# Altium project two_ax_PCB.PrjPcb
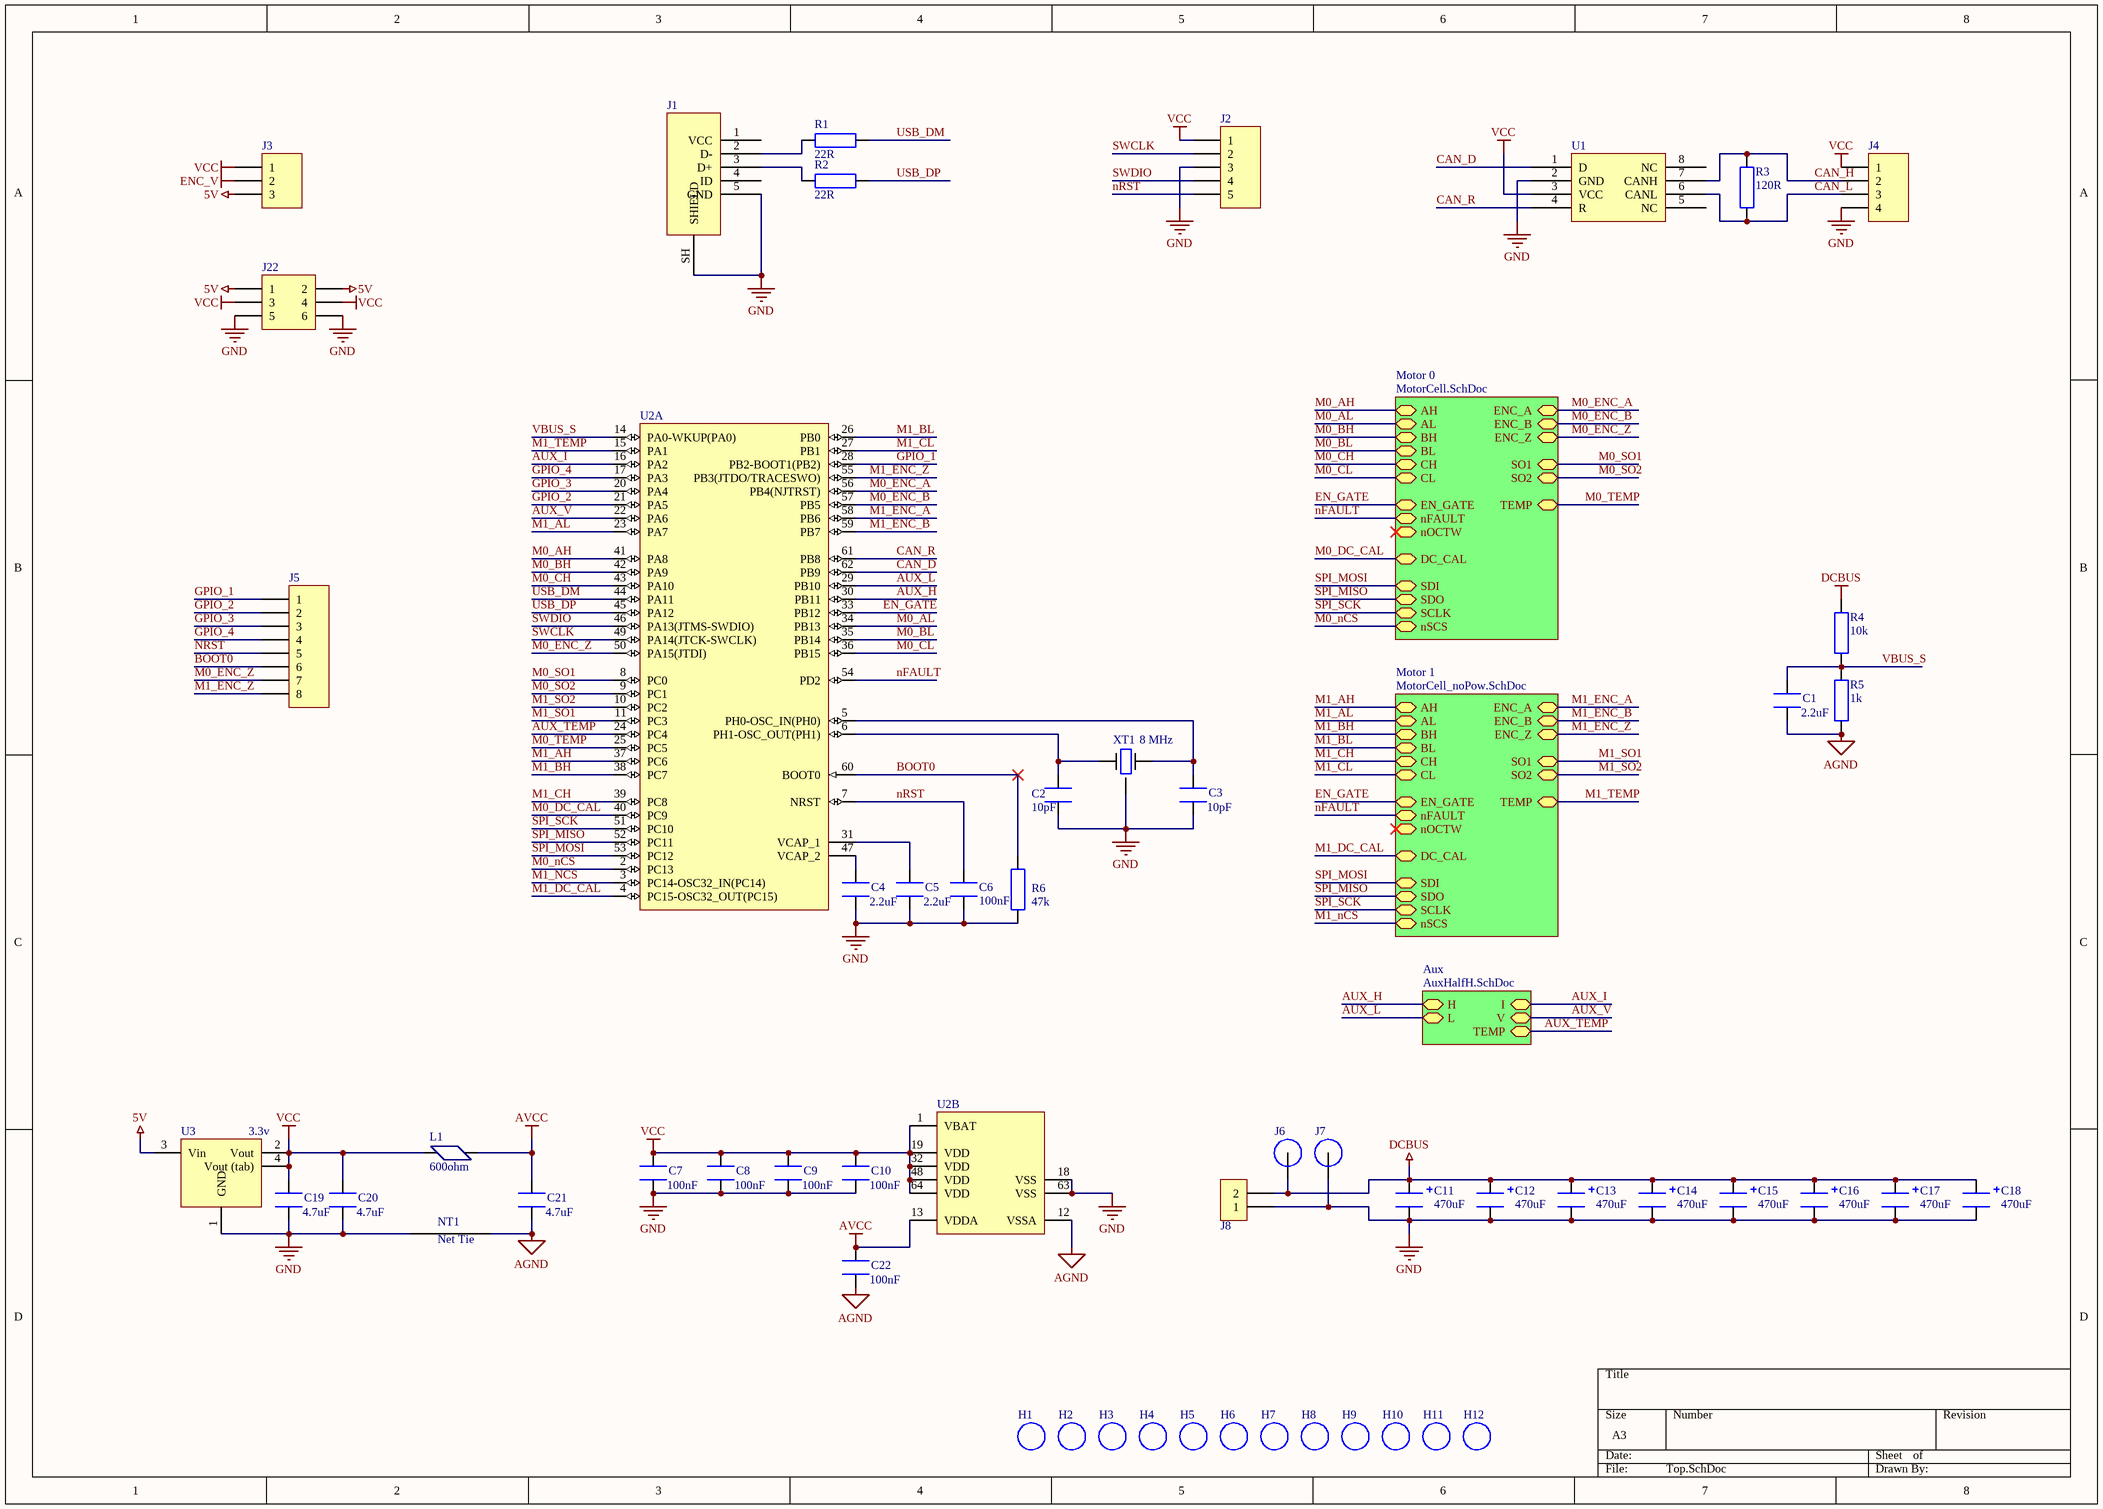
[diagram p0: Top.SchDoc]
4 sheets, 191 parts. Net scope: hierarchical (ports join the sheet entries above them; power ports are global).
Board file: PCB.PcbDoc
Sheets:
  Top.SchDoc
    Motor 0 = MotorCell.SchDoc
    Motor 1 = MotorCell_noPow.SchDoc
    Aux = AuxHalfH.SchDoc

## Sheet Top.SchDoc
size A3; SheetNumber: 1

### Parts
C1  value 2.2uF  [1608[0603]]
C2  value 10pF  [1608[0603]]
C3  value 10pF  [1608[0603]]
C4  value 2.2uF  [1608[0603]]
C5  value 2.2uF  [1608[0603]]
C6  value 100nF  [1608[0603]]
C7  value 100nF  [1608[0603]]
C8  value 100nF  [1608[0603]]
C9  value 100nF  [1608[0603]]
C10  value 100nF  [1608[0603]]
C11  value 470uF  [CAP_ELEC_SIZE_G]
C12  value 470uF  [CAP_ELEC_SIZE_G]
C13  value 470uF  [CAP_ELEC_SIZE_G]
C14  value 470uF  [CAP_ELEC_SIZE_G]
C15  value 470uF  [CAP_ELEC_SIZE_G]
C16  value 470uF  [CAP_ELEC_SIZE_G]
C17  value 470uF  [CAP_ELEC_SIZE_G]
C18  value 470uF  [CAP_ELEC_SIZE_G]
C19  value 4.7uF  [CAPC2012X09N]
C20  value 4.7uF  [CAPC2012X09N]
C21  value 4.7uF  [CAPC2012X09N]
C22  value 100nF  [1608[0603]]
H1  (no value)  [M3 Hole]
H2  (no value)  [M3 Hole]
H3  (no value)  [M3 Hole]
H4  (no value)  [M3 Hole]
H5  (no value)  [M3 Hole]
H6  (no value)  [M3 Hole]
H7  (no value)  [M3 Hole]
H8  (no value)  [M3 Hole]
H9  (no value)  [M3 Hole]
H10  (no value)  [M3 Hole]
H11  (no value)  [M3 Hole]
H12  (no value)  [M3 Hole]
J1  (no value)  [USB_0103594-0001LF]
J2  (no value)  [HDR1X5]
J3  (no value)  [HDR1X3]
J4  (no value)  [HDR1X4]
J5  (no value)  [HDR1X8]
J6  (no value)  [M3 Spade Hole]
J7  (no value)  [M3 Spade Hole]
J8  (no value)  [MC000054]
J22  (no value)  [HDR2X3]
L1  value 600ohm  [FBC2012N]
NT1  (no value)  [NetTie_2mm]  (net tie, no BOM)
R1  value 22R  [RESC1608X55N]
R2  value 22R  [RESC1608X55N]
R3  value 120R  [RESC1608X55N]
R4  value 10k  [RESC1608X55N]
R5  value 1k  [RESC1608X55N]
R6  value 47k  [RESC1608X55N]
U1  (no value)  [SOIC127P600X175-8N]
U2  (no value)  [STM-LQFP64_N]  (parts A,B of 2)
U3  value 3.3v  [SOT223]
XT1  value 8 MHz  [DFN220P320X110-4N]

### Sub-sheets
Aux = AuxHalfH.SchDoc: H, L, I, TEMP, V
Motor 0 = MotorCell.SchDoc: nFAULT, nOCTW, EN_GATE, DC_CAL, SDI, SDO, SCLK, nSCS, SO1, SO2, ENC_A, ENC_B, ENC_Z, AH, AL, BH, BL, CH, CL, TEMP
Motor 1 = MotorCell_noPow.SchDoc: nFAULT, nOCTW, EN_GATE, DC_CAL, SDI, SDO, SCLK, nSCS, SO1, SO2, ENC_A, ENC_B, ENC_Z, AH, AL, BH, BL, CH, CL, TEMP

### Nets
5V: J3.3 J22.1 J22.2 U3.3(Vin)
AGND: C1.1 C21.1 C22.2 NT1.2 R5.2 U2.12(VSSA)
AVCC: C21.2 C22.1 L1.1 U2.13(VDDA)
DCBUS: C11.1 C12.1 C13.1 C14.1 C15.1 C16.1 C17.1 C18.1 J6.1 J8.2 R4.1
ENC_V: J3.2
GND: C2.2 C3.2 C4.1 C5.1 C6.1 C7.2 C8.2 C9.2 C10.2 C11.2 C12.2 C13.2 C14.2 C15.2 C16.2 C17.2 C18.2 C19.1 C20.1 J1.5(GND) J1.SH(SHIELD) J2.3 J4.4 J7.1 J8.1 J22.5 J22.6 NT1.1 R6.2 U1.2(GND) U2.18(VSS) U2.63(VSS) U3.1(GND) XT1.G
VCC: C7.1 C8.1 C9.1 C10.1 C19.2 C20.2 J2.1 J3.1 J4.1 J22.3 J22.4 L1.2 U1.3(VCC) U2.1(VBAT) U2.19(VDD) U2.32(VDD) U2.48(VDD) U2.64(VDD) U3.2(Vout) U3.4(Vout_(tab))
AUX_H: U2.30(PB11) ; sheet Aux/H
AUX_I: U2.16(PA2) ; sheet Aux/I
AUX_L: U2.29(PB10) ; sheet Aux/L
AUX_TEMP: U2.24(PC4) ; sheet Aux/TEMP
AUX_V: U2.22(PA6) ; sheet Aux/V
BOOT0: J5.6 R6.1 U2.60(BOOT0)  [project net BOOT0_1]
CAN_D: U1.1(D) U2.62(PB9)  [project net CAN_D_1]
CAN_H: J4.2 R3.2 U1.7(CANH)  [project net CAN_H_1]
CAN_L: J4.3 R3.1 U1.6(CANL)  [project net CAN_L_1]
CAN_R: U1.4(R) U2.61(PB8)  [project net CAN_R_1]
EN_GATE: U2.33(PB12) ; sheet Motor 0/EN_GATE, sheet Motor 1/EN_GATE
GPIO_1: J5.1 U2.28(PB2-BOOT1(PB2))  [project net GPIO_1_1]
GPIO_2: J5.2 U2.21(PA5)  [project net GPIO_2_1]
GPIO_3: J5.3 U2.20(PA4)  [project net GPIO_3_1]
GPIO_4: J5.4 U2.17(PA3)  [project net GPIO_4_1]
M0_AH: U2.41(PA8) ; sheet Motor 0/AH
M0_AL: U2.34(PB13) ; sheet Motor 0/AL
M0_BH: U2.42(PA9) ; sheet Motor 0/BH
M0_BL: U2.35(PB14) ; sheet Motor 0/BL
M0_CH: U2.43(PA10) ; sheet Motor 0/CH
M0_CL: U2.36(PB15) ; sheet Motor 0/CL
M0_DC_CAL: U2.40(PC9) ; sheet Motor 0/DC_CAL
M0_ENC_A: U2.56(PB4(NJTRST)) ; sheet Motor 0/ENC_A
M0_ENC_B: U2.57(PB5) ; sheet Motor 0/ENC_B
M0_ENC_Z: J5.7 U2.50(PA15(JTDI)) ; sheet Motor 0/ENC_Z
M0_nCS: U2.2(PC13) ; sheet Motor 0/nSCS
M0_SO1: U2.8(PC0) ; sheet Motor 0/SO1
M0_SO2: U2.9(PC1) ; sheet Motor 0/SO2
M0_TEMP: U2.25(PC5) ; sheet Motor 0/TEMP
M1_AH: U2.37(PC6) ; sheet Motor 1/AH
M1_AL: U2.23(PA7) ; sheet Motor 1/AL
M1_BH: U2.38(PC7) ; sheet Motor 1/BH
M1_BL: U2.26(PB0) ; sheet Motor 1/BL
M1_CH: U2.39(PC8) ; sheet Motor 1/CH
M1_CL: U2.27(PB1) ; sheet Motor 1/CL
M1_DC_CAL: U2.4(PC15-OSC32_OUT(PC15)) ; sheet Motor 1/DC_CAL
M1_ENC_A: U2.58(PB6) ; sheet Motor 1/ENC_A
M1_ENC_B: U2.59(PB7) ; sheet Motor 1/ENC_B
M1_ENC_Z: J5.8 U2.55(PB3(JTDO/TRACESWO)) ; sheet Motor 1/ENC_Z
M1_nCS: U2.3(PC14-OSC32_IN(PC14)) ; sheet Motor 1/nSCS
M1_SO1: U2.11(PC3) ; sheet Motor 1/SO1
M1_SO2: U2.10(PC2) ; sheet Motor 1/SO2
M1_TEMP: U2.15(PA1) ; sheet Motor 1/TEMP
nFAULT: U2.54(PD2) ; sheet Motor 0/nFAULT, sheet Motor 1/nFAULT
nRST: C6.2 J2.5 J5.5 U2.7(NRST)  [project net nRST_1]
SPI_MISO: U2.52(PC11) ; sheet Motor 0/SDO, sheet Motor 1/SDO
SPI_MOSI: U2.53(PC12) ; sheet Motor 0/SDI, sheet Motor 1/SDI
SPI_SCK: U2.51(PC10) ; sheet Motor 0/SCLK, sheet Motor 1/SCLK
SWCLK: J2.2 U2.49(PA14(JTCK-SWCLK))  [project net SWCLK_1]
SWDIO: J2.4 U2.46(PA13(JTMS-SWDIO))  [project net SWDIO_1]
USB_DM: R1.2 U2.44(PA11)  [project net USB_DM_1]
USB_DP: R2.2 U2.45(PA12)  [project net USB_DP_1]
VBUS_S: C1.2 R4.2 R5.1 U2.14(PA0-WKUP(PA0))  [project net VBUS_S_1]
NetC2_1: C2.1 U2.6(PH1-OSC_OUT(PH1)) XT1.1
NetC3_1: C3.1 U2.5(PH0-OSC_IN(PH0)) XT1.3
NetC4_2: C4.2 U2.47(VCAP_2)
NetC5_2: C5.2 U2.31(VCAP_1)
NetJ1_2: J1.2(D-) R1.1
NetJ1_3: J1.3(D+) R2.1

Not connected (* = marked no-connect by the designer): J1 1(VCC) 4(ID); U1 5(NC) 8(NC)

### Notes on the sheet
- (in symbol NetTie_2mm) Net Tie

### Library data of the parts
C1-C10 C22 = CAP_0603: CAP General 0603
C11-C18 = EEEFP1E471AP: CAP, FP Series, 470 µF, 25 V, Radial Can - SMD, 10 mm
C19-C21 = GRM219R6YA475KA73D: CAP CER 4.7UF 35V X5R 0805
H1-H12 = M3 Hole: M3 Hole with no copper
J1 = 10103594-0001LF: MICRO USB B, RECEPTACLE, SMT, RA, 5WAY; Supplier 1: Farnell; Supplier Part Number 1: 2293752
J2 = Header 5: Header, 5-Pin; LatestRevisionDate: 17-Jul-2002; LatestRevisionNote: Re-released for DXP Platform.; Publisher: Altium Limited
J3 = Header 3: Header, 3-Pin; LatestRevisionDate: 17-Jul-2002; LatestRevisionNote: Re-released for DXP Platform.; Publisher: Altium Limited
J4 = Header 4: Header, 4-Pin; LatestRevisionDate: 17-Jul-2002; LatestRevisionNote: Re-released for DXP Platform.; Publisher: Altium Limited
J5 = Header 8: Header, 8-Pin; LatestRevisionDate: 17-Jul-2002; LatestRevisionNote: Re-released for DXP Platform.; Publisher: Altium Limited
J6 J7 = M3 Spade Terminal
J8 = MC000054: MULTICOMP Wire-To-Board Terminal Block, 2, 600 V, 30 A, 24 AWG, 10 AWG
J22 = Header 3X2: Header, 3-Pin, Dual row; LatestRevisionDate: 17-Jul-2002; LatestRevisionNote: Re-released for DXP Platform.; Publisher: Altium Limited
L1 = 2508056017Y2: FERRITE BEAD, 0.1OHM, 2A, 0805; Supplier 1: Farnell; Supplier 2: Farnell; Supplier Part Number 1: 1838838; Supplier Part Number 2: 1838838RL
NT1 = NetTie_2mm
R1-R6 = RES_0603: RES General 1% 0603
U1 = SN65HVD232D: 3.3-V CAN Bus Transceiver
U2 = STM32F405RGT6: ARM Cortex-M4 32-bit MCU+FPU, 210 DMIPS, 1024 kB Flash, 192 kB Internal RAM, 51 I/Os, 64-pin LQFP, -40 to 85 degC, Tray; Manufacturer: STMicroelectronics; D/A Converter: 2x12-bit; FLASH Size (Prog) (kB): 1024; I/Os (High Current): 51; Internal RAM Size (kB): 192; Operating Frequency(F) (Processor speed) (MHz): 168; Supply Voltage(Vcc) max (V): 3.6; Supply Voltage(Vcc) min (V): 1.8; DatasheetVersion: Rev. 4; PackageVersion: Rev. 4, 06/2013; PackageReference: LQFP64; PackageDescription: 64-Pin Low Profile Quad Flat Package, 10 x 10 mm Body, 0.5 mm Pitch; Supplier 1: Digi-Key; Supplier Part Number 1: 497-11767-ND; Supplier 2: Farnell; Supplier Part Number 2: 2064363; Supplier 3: Newark; Supplier Part Number 3: 73T2329; Supplier 4: Mouser; Supplier Part Number 4: 511-STM32F405RGT6; Core: ARM Cortex-M4; Packing: Tray; Mounting Technology: Surface Mount; PartNumber: STM32F405RGT6; ComponentLink1Description: Manufacturer URL; ComponentLink1URL: http://www.st.com/web/en/home.html; ComponentLink2Description: Datasheet; ComponentLink2URL: http://www.st.com/st-web-ui/static/active/en/resource/technical/document/datasheet/DM00037051.pdf; ComponentLink3Description: Package Specification; ComponentLink3URL: http://www.st.com/st-web-ui/static/active/en/resource/technical/document/datasheet/DM00037051.pdf
U3 = AP1117E33G-13: IC, LDO, REG, 3.3V, SOT223; Supplier 1: Farnell; Supplier 2: Farnell; Supplier Part Number 1: 1825291RL; Supplier Part Number 2: 1825291
XT1 = ABM3B-8.000MHZ-10-1-U-T: Crystal 8MHz ±10ppm 10pF 200 Ohm -10°C ~ 60°C Surface Mount 4-SMD, No Lead (DFN, LCC)

## Sheet MotorCell.SchDoc
size A3; SheetNumber: 2
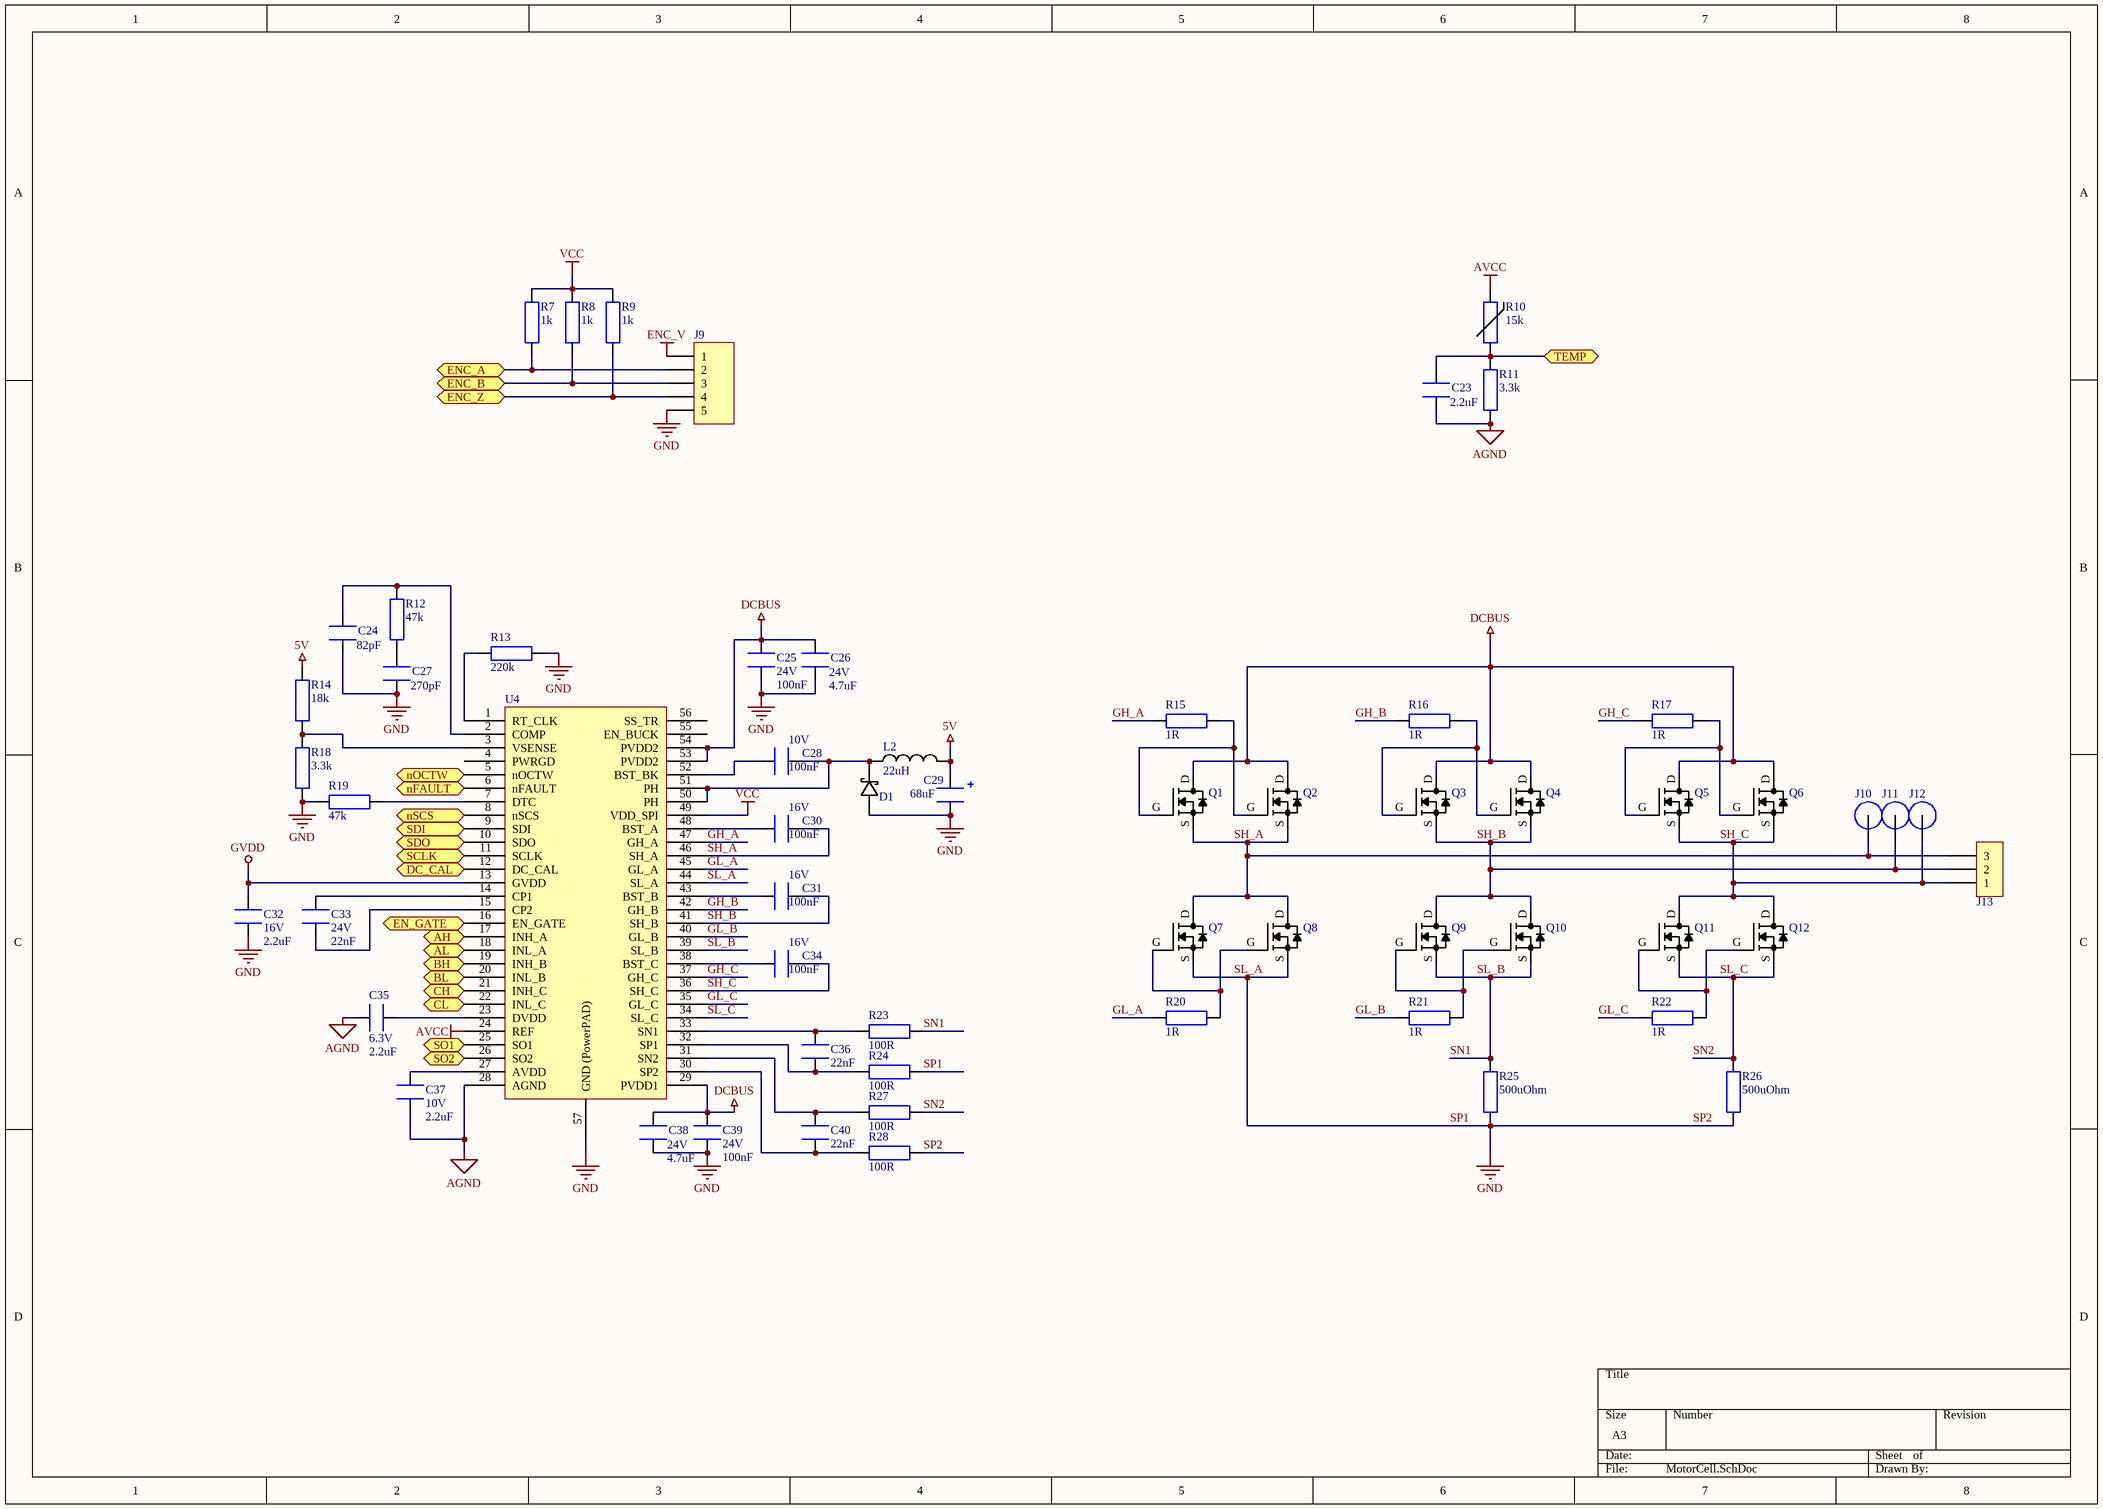
[diagram p1: MotorCell.SchDoc]

### Parts
C23  value 2.2uF  [1608[0603]]
C24  value 82pF  [1608[0603]]
C25  24V  value 100nF  [1608[0603]]
C26  24V  value 4.7uF  [CAPC2012X09N]
C27  value 270pF  [1608[0603]]
C28  10V  value 100nF  [1608[0603]]
C29  value 68uF  [CAPCP6032X28N]
C30  16V  value 100nF  [1608[0603]]
C31  16V  value 100nF  [1608[0603]]
C32  16V  value 2.2uF  [1608[0603]]
C33  24V  value 22nF  [1608[0603]]
C34  16V  value 100nF  [1608[0603]]
C35  6.3V  value 2.2uF  [1608[0603]]
C36  value 22nF  [1608[0603]]
C37  10V  value 2.2uF  [1608[0603]]
C38  24V  value 4.7uF  [CAPC2012X09N]
C39  24V  value 100nF  [1608[0603]]
C40  value 22nF  [1608[0603]]
D1  (no value)  [DO-214AA]
J9  (no value)  [HDR1X5]
J10  (no value)  [M3 Spade Hole]
J11  (no value)  [M3 Spade Hole]
J12  (no value)  [M3 Spade Hole]
J13  (no value)  [MC000051]
L2  value 22uH  [INDC6060X28N]
Q1  (no value)  [SO8FL]
Q2  (no value)  [SO8FL_FILL]
Q3  (no value)  [SO8FL]
Q4  (no value)  [SO8FL_FILL]
Q5  (no value)  [SO8FL]
Q6  (no value)  [SO8FL_FILL]
Q7  (no value)  [SO8FL]
Q8  (no value)  [SO8FL]
Q9  (no value)  [SO8FL]
Q10  (no value)  [SO8FL]
Q11  (no value)  [SO8FL]
Q12  (no value)  [SO8FL]
R7  value 1k  [RESC1608X55N]
R8  value 1k  [RESC1608X55N]
R9  value 1k  [RESC1608X55N]
R10  value 15k  [RESC1608X06L]
R11  value 3.3k  [RESC1608X55N]
R12  value 47k  [RESC1608X55N]
R13  value 220k  [RESC1608X55N]
R14  value 18k  [RESC1608X55N]
R15  value 1R  [RESC1608X55N]
R16  value 1R  [RESC1608X55N]
R17  value 1R  [RESC1608X55N]
R18  value 3.3k  [RESC1608X55N]
R19  value 47k  [RESC1608X55N]
R20  value 1R  [RESC1608X55N]
R21  value 1R  [RESC1608X55N]
R22  value 1R  [RESC1608X55N]
R23  value 100R  [RESC1608X55N]
R24  value 100R  [RESC1608X55N]
R25  value 500uOhm  [RESC6432X09N]
R26  value 500uOhm  [RESC6432X09N]
R27  value 100R  [RESC1608X55N]
R28  value 100R  [RESC1608X55N]
U4  (no value)  [TSSOP50P810X120_HS-57N]

### Ports
AH, AL, BH, BL, CH, CL, DC_CAL, EN_GATE, ENC_A, ENC_B, ENC_Z, nFAULT, nOCTW, nSCS, SCLK, SDI, SDO, SO1, SO2, TEMP

### Nets
5V: C29.1 L2.2 R14.1
AGND: C23.1 C35.1 C37.1 R11.2 U4.28(AGND)
AVCC: R10.2 U4.24(REF)
DCBUS: C25.1 C26.2 C38.2 C39.1 Q1.D Q2.D Q3.D Q4.D Q5.D Q6.D U4.29(PVDD1) U4.53(PVDD2) U4.54(PVDD2)
ENC_V: J9.1
GND: C24.2 C25.2 C26.1 C27.2 C29.2 C32.1 C38.1 C39.2 D1.A J9.5 Q7.S Q8.S R13.2 R18.2 R19.2 R24.1 R25.1 R26.1 R28.1 U4.44(SL_A) U4.57(GND_(PowerPAD))  [also labelled SL_A, SP1, SP2]
GVDD: C32.2 U4.13(GVDD)
VCC: R7.1 R8.1 R9.1 U4.49(VDD_SPI)
EN_GATE: U4.16(EN_GATE) ; port EN_GATE
GH_A: R15.1 U4.47(GH_A)  [project net GH_A_2]
GH_B: R16.1 U4.42(GH_B)  [project net GH_B_2]
GH_C: R17.1 U4.37(GH_C)  [project net GH_C_2]
GL_A: R20.1 U4.45(GL_A)  [project net GL_A_2]
GL_B: R21.1 U4.40(GL_B)  [project net GL_B_2]
GL_C: R22.1 U4.35(GL_C)  [project net GL_C_2]
M0_AH: U4.17(INH_A) ; port AH
M0_AL: U4.18(INL_A) ; port AL
M0_BH: U4.19(INH_B) ; port BH
M0_BL: U4.20(INL_B) ; port BL
M0_CH: U4.21(INH_C) ; port CH
M0_CL: U4.22(INL_C) ; port CL
M0_DC_CAL: U4.12(DC_CAL) ; port DC_CAL
M0_ENC_A: J9.2 R7.2 ; port ENC_A
M0_ENC_B: J9.3 R8.2 ; port ENC_B
M0_ENC_Z: J9.4 R9.2 ; port ENC_Z
M0_nCS: U4.8(nSCS) ; port nSCS
M0_SO1: U4.25(SO1) ; port SO1
M0_SO2: U4.26(SO2) ; port SO2
M0_TEMP: C23.2 R10.1 R11.1 ; port TEMP
nFAULT: U4.6(nFAULT) ; port nFAULT
SH_A: C30.1 J10.1 J13.3 Q1.S Q2.S Q7.D Q8.D U4.46(SH_A)  [project net SH_A_2]
SH_B: C31.1 J11.1 J13.2 Q3.S Q4.S Q9.D Q10.D U4.41(SH_B)  [project net SH_B_2]
SH_C: C34.1 J12.1 J13.1 Q5.S Q6.S Q11.D Q12.D U4.36(SH_C)  [project net SH_C_2]
SL_B: Q9.S Q10.S R23.1 R25.2 U4.39(SL_B)  [also labelled SN1]  [project net SL_B_2]
SL_C: Q11.S Q12.S R26.2 R27.1 U4.34(SL_C)  [also labelled SN2]  [project net SL_C_2]
SPI_MISO: U4.10(SDO) ; port SDO
SPI_MOSI: U4.9(SDI) ; port SDI
SPI_SCK: U4.11(SCLK) ; port SCLK
NetC24_1: C24.1 R12.1 U4.2(COMP)
NetC27_1: C27.1 R12.2
NetC28_1: C28.1 D1.K L2.1 U4.50(PH) U4.51(PH)
NetC28_2: C28.2 U4.52(BST_BK)
NetC30_2: C30.2 U4.48(BST_A)
NetC31_2: C31.2 U4.43(BST_B)
NetC33_1: C33.1 U4.14(CP1)
NetC33_2: C33.2 U4.15(CP2)
NetC34_2: C34.2 U4.38(BST_C)
NetC35_2: C35.2 U4.23(DVDD)
NetC36_1: C36.1 R23.2 U4.33(SN1)
NetC36_2: C36.2 R24.2 U4.32(SP1)
NetC37_2: C37.2 U4.27(AVDD)
NetC40_1: C40.1 R27.2 U4.31(SN2)
NetC40_2: C40.2 R28.2 U4.30(SP2)
NetQ1_G: Q1.G Q2.G R15.2
NetQ3_G: Q3.G Q4.G R16.2
NetQ5_G: Q5.G Q6.G R17.2
NetQ7_G: Q7.G Q8.G R20.2
NetQ9_G: Q9.G Q10.G R21.2
NetQ11_G: Q11.G Q12.G R22.2
NetR13_1: R13.1 U4.1(RT_CLK)
NetR14_2: R14.2 R18.1 U4.3(VSENSE)
NetR19_1: R19.1 U4.7(DTC)
NetU4_5: U4.5(nOCTW) ; port nOCTW

Not connected (* = marked no-connect by the designer): U4 4(PWRGD) 55(EN_BUCK) 56(SS_TR)

### Library data of the parts
C23-C25 C27 C28 C30-C37 C39 C40 = CAP_0603: CAP General 0603
C26 C38 = GRM219R6YA475KA73D: CAP CER 4.7UF 35V X5R 0805
C29 = T495C686M016ATE250: CAP TANT 68UF 16V 20% 2312 250mOhm
D1 = SS13B: DIODE, SCHOTTK, RECTIF, 1A, 30V, SMB; Supplier 1: Farnell; Supplier Part Number 1: 1861425
J9 = Header 5: Header, 5-Pin; LatestRevisionDate: 17-Jul-2002; LatestRevisionNote: Re-released for DXP Platform.; Publisher: Altium Limited
J10-J12 = M3 Spade Terminal
J13 = MC000051: TERMINAL BLOCK, WIRE TO BRD, 3POS, 10AWG; Supplier 1: Farnell; Supplier Part Number 1: 2008022
L2 = NR6028T220M: INDUCTOR 22UH 1.4A 175.5 MOHM
Q1-Q12 = NTMFS4937NT1G: MOSFET, N CH, 30V, 70A, SO-8 FL; Supplier 1: Farnell; Supplier Part Number 1: 2317605; Supplier 2: Farnell; Supplier Part Number 2: 2317605RL
R7-R9 R11-R24 R27 R28 = RES_0603: RES General 1% 0603
R10 = NTCS0603E3153JMT: THERMISTOR, 15K, 5%, SMD, NTC; Supplier 1: Farnell; Supplier Part Number 1: 2103168
R25 R26 = CSR2512C0R0005F: RES SMD 0.0005 OHM 1% 3W 2512
U4 = DRV8301: MOTOR DRIVER, 3PH, 56HTSSOP

## Sheet MotorCell_noPow.SchDoc
size A3; SheetNumber: 3
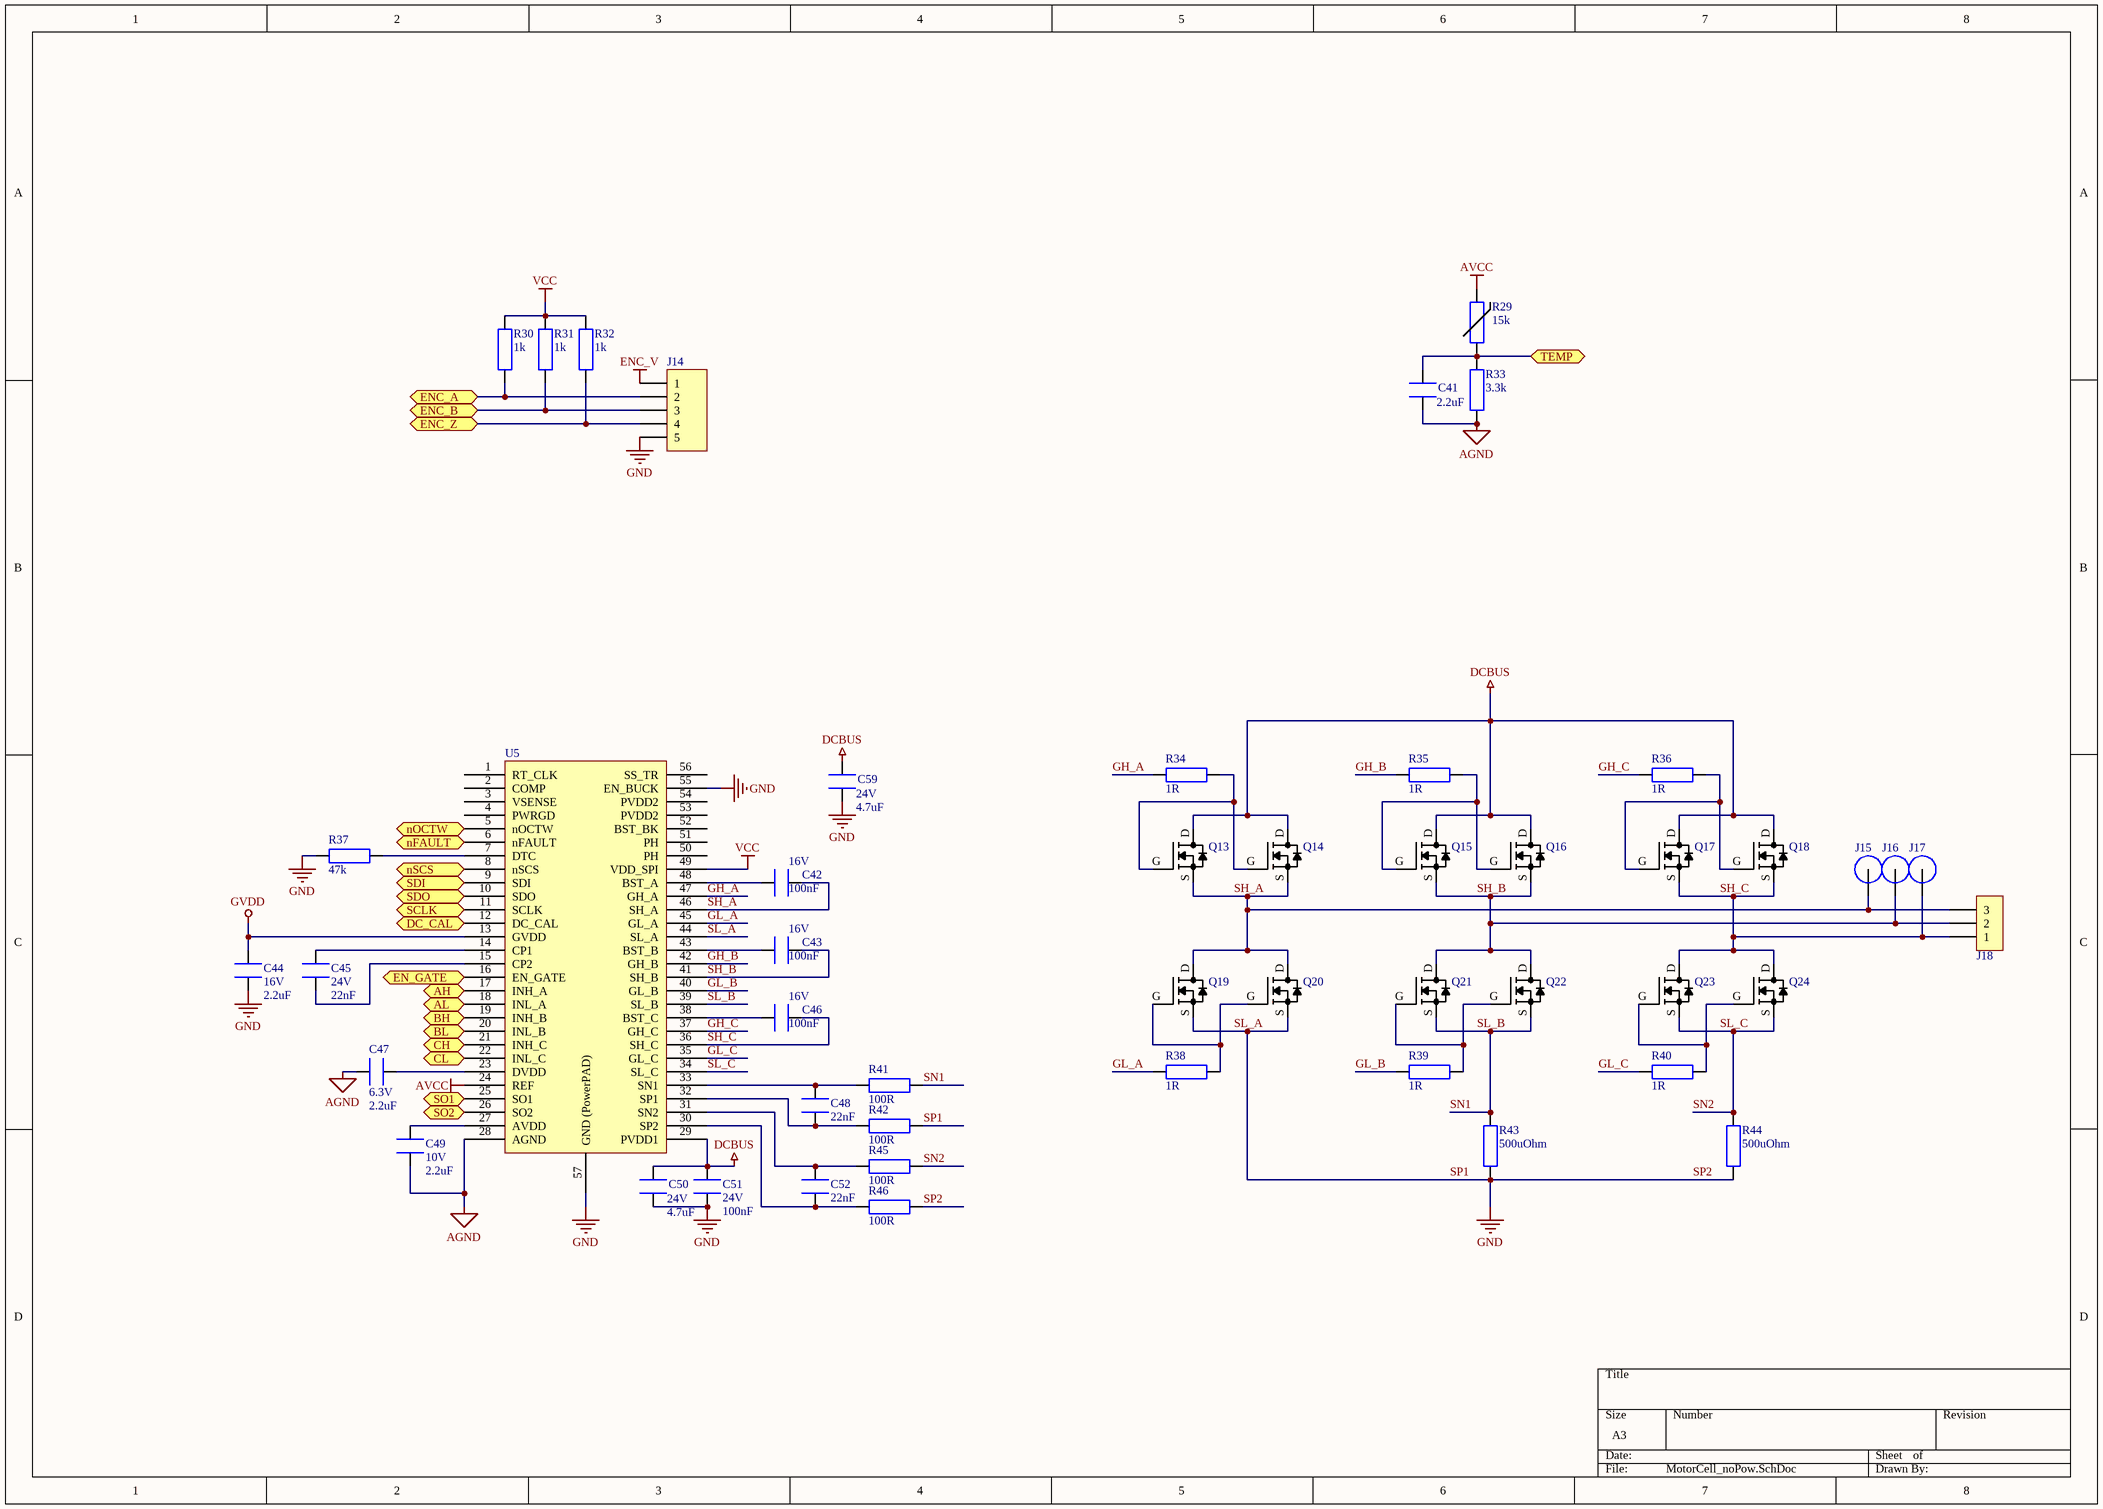
[diagram p2: MotorCell_noPow.SchDoc]

### Parts
C41  value 2.2uF  [1608[0603]]
C42  16V  value 100nF  [1608[0603]]
C43  16V  value 100nF  [1608[0603]]
C44  16V  value 2.2uF  [1608[0603]]
C45  24V  value 22nF  [1608[0603]]
C46  16V  value 100nF  [1608[0603]]
C47  6.3V  value 2.2uF  [1608[0603]]
C48  value 22nF  [1608[0603]]
C49  10V  value 2.2uF  [1608[0603]]
C50  24V  value 4.7uF  [CAPC2012X09N]
C51  24V  value 100nF  [1608[0603]]
C52  value 22nF  [1608[0603]]
C59  24V  value 4.7uF  [CAPC2012X09N]
J14  (no value)  [HDR1X5]
J15  (no value)  [M3 Spade Hole]
J16  (no value)  [M3 Spade Hole]
J17  (no value)  [M3 Spade Hole]
J18  (no value)  [MC000051]
Q13  (no value)  [SO8FL]
Q14  (no value)  [SO8FL_FILL]
Q15  (no value)  [SO8FL]
Q16  (no value)  [SO8FL_FILL]
Q17  (no value)  [SO8FL]
Q18  (no value)  [SO8FL_FILL]
Q19  (no value)  [SO8FL]
Q20  (no value)  [SO8FL]
Q21  (no value)  [SO8FL]
Q22  (no value)  [SO8FL]
Q23  (no value)  [SO8FL]
Q24  (no value)  [SO8FL]
R29  value 15k  [RESC1608X06L]
R30  value 1k  [RESC1608X55N]
R31  value 1k  [RESC1608X55N]
R32  value 1k  [RESC1608X55N]
R33  value 3.3k  [RESC1608X55N]
R34  value 1R  [RESC1608X55N]
R35  value 1R  [RESC1608X55N]
R36  value 1R  [RESC1608X55N]
R37  value 47k  [RESC1608X55N]
R38  value 1R  [RESC1608X55N]
R39  value 1R  [RESC1608X55N]
R40  value 1R  [RESC1608X55N]
R41  value 100R  [RESC1608X55N]
R42  value 100R  [RESC1608X55N]
R43  value 500uOhm  [RESC6432X09N]
R44  value 500uOhm  [RESC6432X09N]
R45  value 100R  [RESC1608X55N]
R46  value 100R  [RESC1608X55N]
U5  (no value)  [TSSOP50P810X120_HS-57N]

### Ports
AH, AL, BH, BL, CH, CL, DC_CAL, EN_GATE, ENC_A, ENC_B, ENC_Z, nFAULT, nOCTW, nSCS, SCLK, SDI, SDO, SO1, SO2, TEMP

### Nets
AGND: C41.1 C47.1 C49.1 R33.2 U5.28(AGND)
AVCC: R29.2 U5.24(REF)
DCBUS: C50.2 C51.1 C59.2 Q13.D Q14.D Q15.D Q16.D Q17.D Q18.D U5.29(PVDD1)
ENC_V: J14.1
GND: C44.1 C50.1 C51.2 C59.1 J14.5 Q19.S Q20.S R37.2 R42.1 R43.1 R44.1 R46.1 U5.44(SL_A) U5.55(EN_BUCK) U5.57(GND_(PowerPAD))  [also labelled SL_A, SP1, SP2]
GVDD: C44.2 U5.13(GVDD)
VCC: R30.1 R31.1 R32.1 U5.49(VDD_SPI)
EN_GATE: U5.16(EN_GATE) ; port EN_GATE
GH_A: R34.1 U5.47(GH_A)  [project net GH_A_3]
GH_B: R35.1 U5.42(GH_B)  [project net GH_B_3]
GH_C: R36.1 U5.37(GH_C)  [project net GH_C_3]
GL_A: R38.1 U5.45(GL_A)  [project net GL_A_3]
GL_B: R39.1 U5.40(GL_B)  [project net GL_B_3]
GL_C: R40.1 U5.35(GL_C)  [project net GL_C_3]
M1_AH: U5.17(INH_A) ; port AH
M1_AL: U5.18(INL_A) ; port AL
M1_BH: U5.19(INH_B) ; port BH
M1_BL: U5.20(INL_B) ; port BL
M1_CH: U5.21(INH_C) ; port CH
M1_CL: U5.22(INL_C) ; port CL
M1_DC_CAL: U5.12(DC_CAL) ; port DC_CAL
M1_ENC_A: J14.2 R30.2 ; port ENC_A
M1_ENC_B: J14.3 R31.2 ; port ENC_B
M1_ENC_Z: J14.4 R32.2 ; port ENC_Z
M1_nCS: U5.8(nSCS) ; port nSCS
M1_SO1: U5.25(SO1) ; port SO1
M1_SO2: U5.26(SO2) ; port SO2
M1_TEMP: C41.2 R29.1 R33.1 ; port TEMP
nFAULT: U5.6(nFAULT) ; port nFAULT
SH_A: C42.1 J15.1 J18.3 Q13.S Q14.S Q19.D Q20.D U5.46(SH_A)  [project net SH_A_3]
SH_B: C43.1 J16.1 J18.2 Q15.S Q16.S Q21.D Q22.D U5.41(SH_B)  [project net SH_B_3]
SH_C: C46.1 J17.1 J18.1 Q17.S Q18.S Q23.D Q24.D U5.36(SH_C)  [project net SH_C_3]
SL_B: Q21.S Q22.S R41.1 R43.2 U5.39(SL_B)  [also labelled SN1]  [project net SL_B_3]
SL_C: Q23.S Q24.S R44.2 R45.1 U5.34(SL_C)  [also labelled SN2]  [project net SL_C_3]
SPI_MISO: U5.10(SDO) ; port SDO
SPI_MOSI: U5.9(SDI) ; port SDI
SPI_SCK: U5.11(SCLK) ; port SCLK
NetC42_2: C42.2 U5.48(BST_A)
NetC43_2: C43.2 U5.43(BST_B)
NetC45_1: C45.1 U5.14(CP1)
NetC45_2: C45.2 U5.15(CP2)
NetC46_2: C46.2 U5.38(BST_C)
NetC47_2: C47.2 U5.23(DVDD)
NetC48_1: C48.1 R41.2 U5.33(SN1)
NetC48_2: C48.2 R42.2 U5.32(SP1)
NetC49_2: C49.2 U5.27(AVDD)
NetC52_1: C52.1 R45.2 U5.31(SN2)
NetC52_2: C52.2 R46.2 U5.30(SP2)
NetQ13_G: Q13.G Q14.G R34.2
NetQ15_G: Q15.G Q16.G R35.2
NetQ17_G: Q17.G Q18.G R36.2
NetQ19_G: Q19.G Q20.G R38.2
NetQ21_G: Q21.G Q22.G R39.2
NetQ23_G: Q23.G Q24.G R40.2
NetR37_1: R37.1 U5.7(DTC)
NetU5_5: U5.5(nOCTW) ; port nOCTW

Not connected (* = marked no-connect by the designer): U5 1(RT_CLK) 2(COMP) 3(VSENSE) 4(PWRGD) 50(PH) 51(PH) 52(BST_BK) 53(PVDD2) 54(PVDD2) 56(SS_TR)

### Library data of the parts
C41-C49 C51 C52 = CAP_0603: CAP General 0603
C50 C59 = GRM219R6YA475KA73D: CAP CER 4.7UF 35V X5R 0805
J14 = Header 5: Header, 5-Pin; LatestRevisionDate: 17-Jul-2002; LatestRevisionNote: Re-released for DXP Platform.; Publisher: Altium Limited
J15-J17 = M3 Spade Terminal
J18 = MC000051: TERMINAL BLOCK, WIRE TO BRD, 3POS, 10AWG; Supplier 1: Farnell; Supplier Part Number 1: 2008022
Q13-Q24 = NTMFS4937NT1G: MOSFET, N CH, 30V, 70A, SO-8 FL; Supplier 1: Farnell; Supplier Part Number 1: 2317605; Supplier 2: Farnell; Supplier Part Number 2: 2317605RL
R29 = NTCS0603E3153JMT: THERMISTOR, 15K, 5%, SMD, NTC; Supplier 1: Farnell; Supplier Part Number 1: 2103168
R30-R42 R45 R46 = RES_0603: RES General 1% 0603
R43 R44 = CSR2512C0R0005F: RES SMD 0.0005 OHM 1% 3W 2512
U5 = DRV8301: MOTOR DRIVER, 3PH, 56HTSSOP

## Sheet AuxHalfH.SchDoc
size A3; SheetNumber: 4
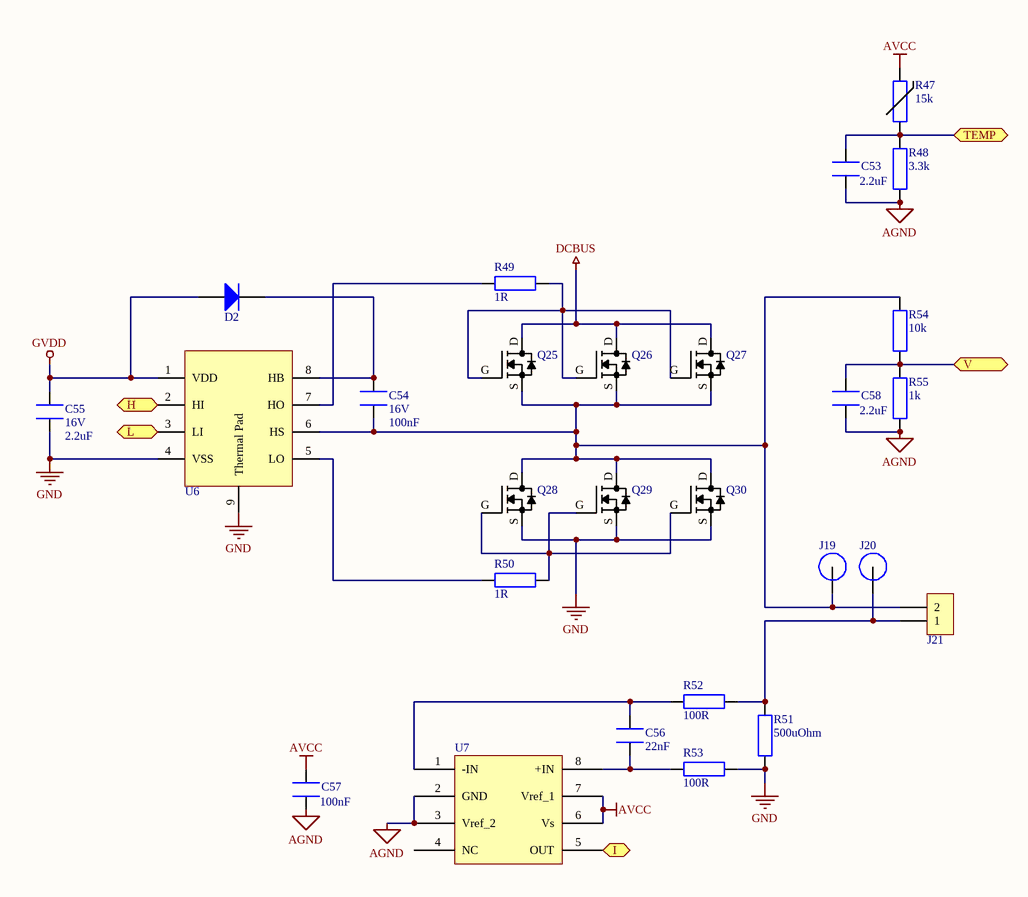
[diagram p3: AuxHalfH.SchDoc]

### Parts
C53  value 2.2uF  [1608[0603]]
C54  16V  value 100nF  [1608[0603]]
C55  16V  value 2.2uF  [1608[0603]]
C56  value 22nF  [1608[0603]]
C57  value 100nF  [1608[0603]]
C58  value 2.2uF  [1608[0603]]
D2  (no value)  [DIOM2717X10N]
J19  (no value)  [M3 Spade Hole]
J20  (no value)  [M3 Spade Hole]
J21  (no value)  [MC000054]
Q25  (no value)  [SO8FL_FILL]
Q26  (no value)  [SO8FL]
Q27  (no value)  [SO8FL_FILL]
Q28  (no value)  [SO8FL]
Q29  (no value)  [SO8FL]
Q30  (no value)  [SO8FL]
R47  value 15k  [RESC1608X06L]
R48  value 3.3k  [RESC1608X55N]
R49  value 1R  [RESC1608X55N]
R50  value 1R  [RESC1608X55N]
R51  value 500uOhm  [RESC6432X09N]
R52  value 100R  [RESC1608X55N]
R53  value 100R  [RESC1608X55N]
R54  value 10k  [RESC1608X55N]
R55  value 1k  [RESC1608X55N]
U6  (no value)  [SON80P400X80_HS-9N]
U7  (no value)  [SOIC127P600X175-8N]

### Ports
H, I, L, TEMP, V

### Nets
AGND: C53.1 C57.2 C58.1 R48.2 R55.2 U7.2(GND) U7.3(Vref_2)
AVCC: C57.1 R47.2 U7.6(Vs) U7.7(Vref_1)
DCBUS: Q25.D Q26.D Q27.D
GND: C55.1 Q28.S Q29.S Q30.S R51.2 R53.2 U6.4(VSS) U6.9(Thermal_Pad)
GVDD: C55.2 D2.A U6.1(VDD)
AUX_H: U6.2(HI) ; port H
AUX_I: U7.5(OUT) ; port I
AUX_L: U6.3(LI) ; port L
AUX_TEMP: C53.2 R47.1 R48.1 ; port TEMP
AUX_V: C58.2 R54.2 R55.1 ; port V
NetC54_1: C54.1 D2.K U6.8(HB)
NetC54_2: C54.2 J19.1 J21.2 Q25.S Q26.S Q27.S Q28.D Q29.D Q30.D R54.1 U6.6(HS)
NetC56_1: C56.1 R52.1 U7.1(-IN)
NetC56_2: C56.2 R53.1 U7.8(+IN)
NetJ20_1: J20.1 J21.1 R51.1 R52.2
NetQ25_G: Q25.G Q26.G Q27.G R49.2
NetQ28_G: Q28.G Q29.G Q30.G R50.2
NetR49_1: R49.1 U6.7(HO)
NetR50_1: R50.1 U6.5(LO)

Not connected (* = marked no-connect by the designer): U7 4(NC)

### Library data of the parts
C53-C58 = CAP_0603: CAP General 0603
D2 = MBR140SFT1G: Rectifier Diode, Single, 40 V, 1 A, SOD-123FL, 2, 550 mV
J19 J20 = M3 Spade Terminal
J21 = MC000054: as J8 on sheet Top
Q25-Q30 = NTMFS4937NT1G: MOSFET, N CH, 30V, 70A, SO-8 FL; Supplier 1: Farnell; Supplier Part Number 1: 2317605; Supplier 2: Farnell; Supplier Part Number 2: 2317605RL
R47 = NTCS0603E3153JMT: THERMISTOR, 15K, 5%, SMD, NTC; Supplier 1: Farnell; Supplier Part Number 1: 2103168
R48-R50 R52-R55 = RES_0603: RES General 1% 0603
R51 = CSR2512C0R0005F: RES SMD 0.0005 OHM 1% 3W 2512
U6 = LM5109BSD/NOPB: DRIVER, MOSFET, HALF BRIDGE, WSON-8, 1A; Supplier 1: Farnell; Supplier Part Number 1: 2400642RL; Supplier 2: Farnell; Supplier Part Number 2: 2400642; Supplier 3: Farnell; Supplier Part Number 3: 2382850
U7 = AD8418WBRZ: ANALOG DEVICES Current Sense Amplifier, Bidirectional, 1, 130 µA, NSOIC

## Nets that join several sheets
5V: Top (J3.3 J22.1 J22.2 U3.3), MotorCell (C29.1 L2.2 R14.1)
AGND: Top (6 pins), MotorCell (5 pins), MotorCell_noPow (5 pins), AuxHalfH (7 pins)
AVCC: Top (C21.2 C22.1 L1.1 U2.13), MotorCell (R10.2 U4.24), MotorCell_noPow (R29.2 U5.24), AuxHalfH (C57.1 R47.2 U7.6 U7.7)
DCBUS: Top (11 pins), MotorCell (13 pins), MotorCell_noPow (10 pins), AuxHalfH (Q25.D Q26.D Q27.D)
ENC_V: Top (J3.2), MotorCell (J9.1), MotorCell_noPow (J14.1)
GND: Top (34 pins), MotorCell (21 pins), MotorCell_noPow (15 pins), AuxHalfH (8 pins)
GVDD: MotorCell (C32.2 U4.13), MotorCell_noPow (C44.2 U5.13), AuxHalfH (C55.2 D2.A U6.1)
VCC: Top (20 pins), MotorCell (R7.1 R8.1 R9.1 U4.49), MotorCell_noPow (R30.1 R31.1 R32.1 U5.49)
AUX_H: Top (U2.30), AuxHalfH (U6.2)
AUX_I: Top (U2.16), AuxHalfH (U7.5)
AUX_L: Top (U2.29), AuxHalfH (U6.3)
AUX_TEMP: Top (U2.24), AuxHalfH (C53.2 R47.1 R48.1)
AUX_V: Top (U2.22), AuxHalfH (C58.2 R54.2 R55.1)
EN_GATE: Top (U2.33), MotorCell (U4.16), MotorCell_noPow (U5.16)
M0_AH: Top (U2.41), MotorCell (U4.17)
M0_AL: Top (U2.34), MotorCell (U4.18)
M0_BH: Top (U2.42), MotorCell (U4.19)
M0_BL: Top (U2.35), MotorCell (U4.20)
M0_CH: Top (U2.43), MotorCell (U4.21)
M0_CL: Top (U2.36), MotorCell (U4.22)
M0_DC_CAL: Top (U2.40), MotorCell (U4.12)
M0_ENC_A: Top (U2.56), MotorCell (J9.2 R7.2)
M0_ENC_B: Top (U2.57), MotorCell (J9.3 R8.2)
M0_ENC_Z: Top (J5.7 U2.50), MotorCell (J9.4 R9.2)
M0_nCS: Top (U2.2), MotorCell (U4.8)
M0_SO1: Top (U2.8), MotorCell (U4.25)
M0_SO2: Top (U2.9), MotorCell (U4.26)
M0_TEMP: Top (U2.25), MotorCell (C23.2 R10.1 R11.1)
M1_AH: Top (U2.37), MotorCell_noPow (U5.17)
M1_AL: Top (U2.23), MotorCell_noPow (U5.18)
M1_BH: Top (U2.38), MotorCell_noPow (U5.19)
M1_BL: Top (U2.26), MotorCell_noPow (U5.20)
M1_CH: Top (U2.39), MotorCell_noPow (U5.21)
M1_CL: Top (U2.27), MotorCell_noPow (U5.22)
M1_DC_CAL: Top (U2.4), MotorCell_noPow (U5.12)
M1_ENC_A: Top (U2.58), MotorCell_noPow (J14.2 R30.2)
M1_ENC_B: Top (U2.59), MotorCell_noPow (J14.3 R31.2)
M1_ENC_Z: Top (J5.8 U2.55), MotorCell_noPow (J14.4 R32.2)
M1_nCS: Top (U2.3), MotorCell_noPow (U5.8)
M1_SO1: Top (U2.11), MotorCell_noPow (U5.25)
M1_SO2: Top (U2.10), MotorCell_noPow (U5.26)
M1_TEMP: Top (U2.15), MotorCell_noPow (C41.2 R29.1 R33.1)
nFAULT: Top (U2.54), MotorCell (U4.6), MotorCell_noPow (U5.6)
SPI_MISO: Top (U2.52), MotorCell (U4.10), MotorCell_noPow (U5.10)
SPI_MOSI: Top (U2.53), MotorCell (U4.9), MotorCell_noPow (U5.9)
SPI_SCK: Top (U2.51), MotorCell (U4.11), MotorCell_noPow (U5.11)

## Assembly variants
Populated: not fitted R3